# Altium schematic sheet ESP8266.SchDoc
size A3; Organization: Altium Limited; Address1: L3, 12a Rodborough Rd; Address2: Frenchs Forest; Address3: NSW; Address4: Australia 2086
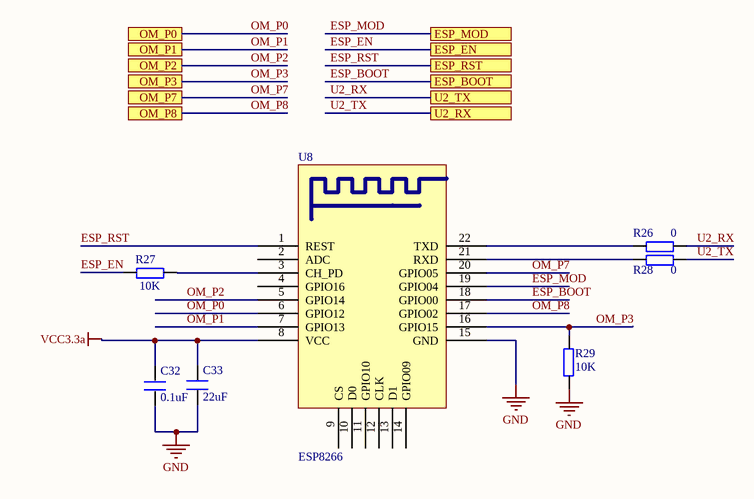
[diagram p0: ESP8266.SchDoc]

## Parts
C32  0.1uF  [0603P]
C33  22uF  [0603P]
R26  0  [0603P]
R27  10K  [0603P]
R28  0  [0603P]
R29  10K  [0603P]
U8  ESP8266  [ESP_12]

## Ports
ESP_BOOT, ESP_EN, ESP_MOD, ESP_RST, OM_P0, OM_P1, OM_P2, OM_P3, OM_P7, OM_P8, U2_RX, U2_TX

## Nets
GND: C32.1 C33.1 R29.2 U8.15(GND)
VCC3.3a: C32.2 C33.2 U8.8(VCC)
ESP_BOOT: U8.18(GPIO00) ; port ESP_BOOT
ESP_EN: R27.1 ; port ESP_EN
ESP_MOD: U8.19(GPIO04) ; port ESP_MOD
ESP_RST: U8.1(REST) ; port ESP_RST
OM_P0: U8.6(GPIO12) ; port OM_P0
OM_P1: U8.7(GPIO13) ; port OM_P1
OM_P2: U8.5(GPIO14) ; port OM_P2
OM_P3: R29.1 U8.16(GPIO15) ; port OM_P3
OM_P7: U8.20(GPIO05) ; port OM_P7
OM_P8: U8.17(GPIO02) ; port OM_P8
U2_RX: R26.2 ; port U2_TX
U2_TX: R28.2 ; port U2_RX
NetR26_1: R26.1 U8.22(TXD)
NetR27_2: R27.2 U8.3(CH_PD)
NetR28_1: R28.1 U8.21(RXD)

Not connected (* = marked no-connect by the designer): U8 2(ADC) 4(GPIO16) 9(CS) 10(D0) 11(GPIO10) 12(CLK) 13(D1) 14(GPIO09)

## Notes on the sheet
- Title
- Size:
- Date:
- A3
- Number:
- Time:
- Revision:
- Sheet
- of
- File:

## Library data of the parts
C32 C33 = C
R26-R29 = R